# Altium project Thunderscope_Rev3.PrjPCB
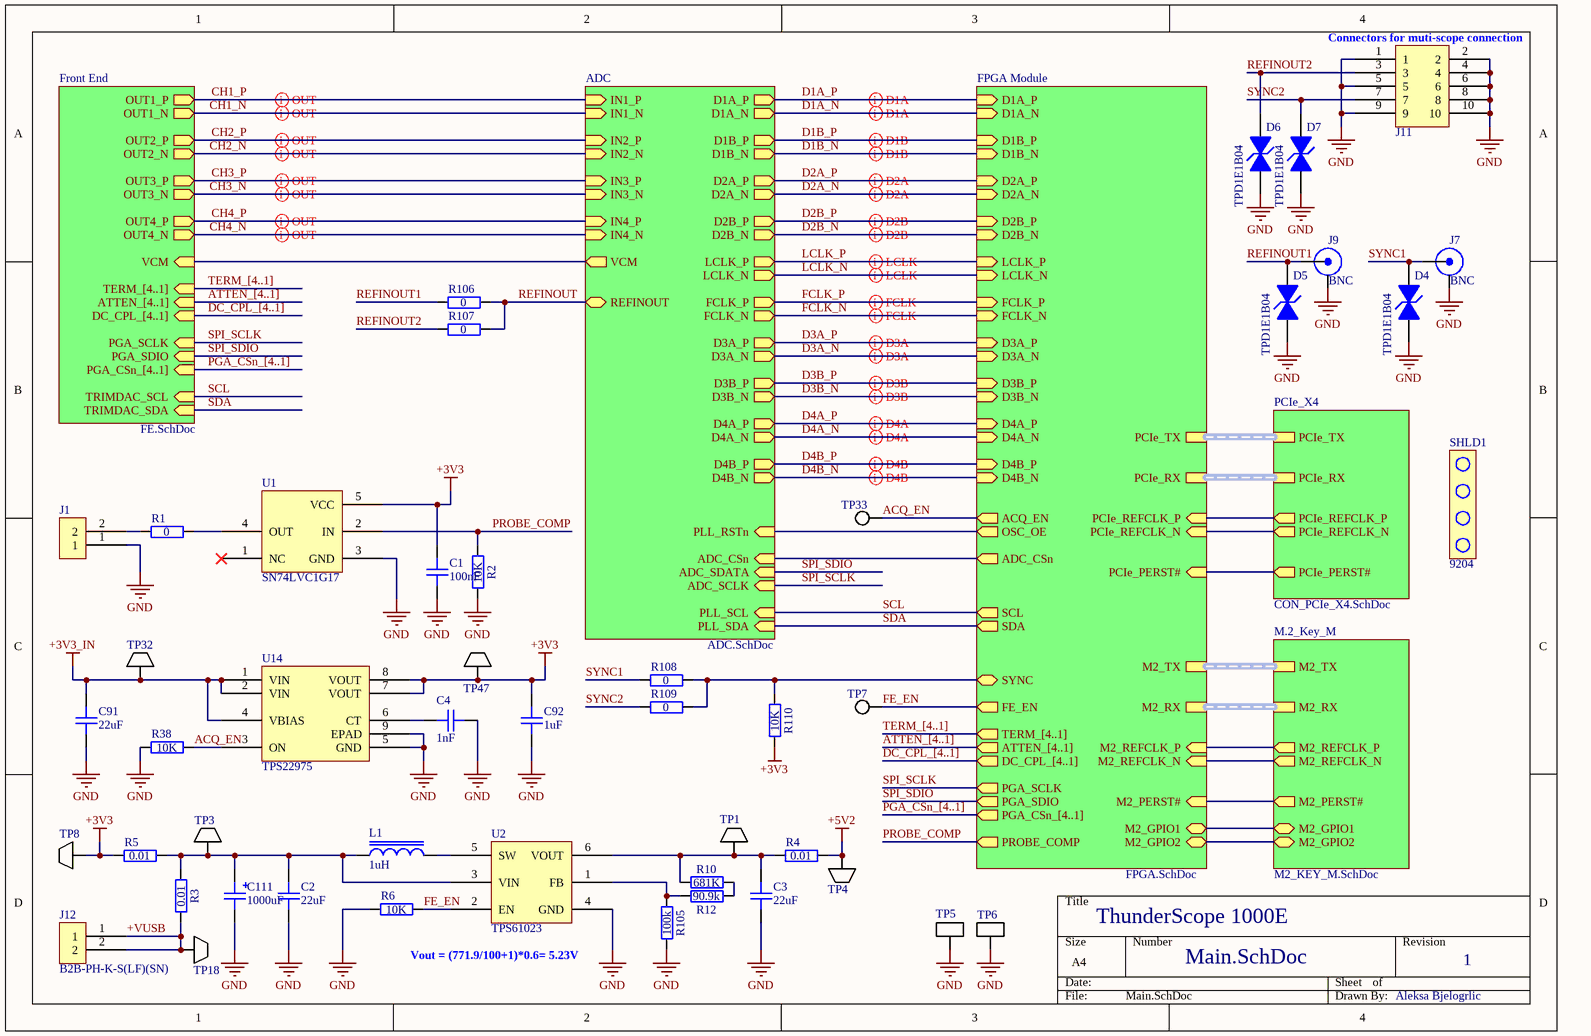
[diagram p0: Main.SchDoc]
Template Notes: - Nominal values used, dimensions in mm  - The mounting holes and keep-out areas around them are only required when the I/O bracket is mounted on the card directly  - Component height rule and clearance rule derived from PCI_Express_CEM_r2.0.pdf, Page 84.  - Stackup is not specified in PCI_Express_CEM_r2.0.pdf, nor implemented in this template.; Template Revision Date: Oct 29, 2010; Template Source Document: Outline:PCI_Express_CEM_r2.0.pdf  Pinout:PCI_Express_CEM_r2.0.pdf; Template Source Organization: PCI-SIG; Template Source Revision Date: R2.0, April 11, 2007; Template Source URL: http://www.pcisig.com; Title: ThunderScope 1000E
5 sheets, 147 parts. Net scope: hierarchical (ports join the sheet entries above them; power ports are global).
Board file: Thunderscope_Rev3.PCBDOC
Sheets:
  Main.SchDoc
    FPGA Module = FPGA.SchDoc
    M.2_Key_M = M2_KEY_M.SchDoc
    PCIe_X4 = CON_PCIe_X4.SchDoc
  PLL.SchDoc

## Sheet Main.SchDoc: ThunderScope 1000E
size A4; DrawnBy: Aleksa Bjelogrlic; Revision: 1

### Parts
C1  100nF  [GEN_C_0402]
C2  22uF  [GEN_C_0805]
C3  22uF  [GEN_C_0805]
C4  1nF  [GEN_C_0402]
C91  22uF  [GEN_C_0805]
C92  1uF  [GEN_C_0402]
C111  1000uF  [GEN_C_POLAR_10mm]
D4  TPD1E1B04  [TI_X1SON_DPY0002A]
D5  TPD1E1B04  [TI_X1SON_DPY0002A]
D6  TPD1E1B04  [TI_X1SON_DPY0002A]
D7  TPD1E1B04  [TI_X1SON_DPY0002A]
J1  TSW-101-08-F-D-RA  [GEN_2.54mm_1x2_Pin_TH_RA]  (value not drawn)
J7  BNC  [MOL_0731000105]
J9  BNC  [MOL_0731000105]
J11  1.27mm 6 Pin TH  [GEN_1.27mm_2x5_Pin_TH_RA]  (value not drawn)
J12  B2B-PH-K-S(LF)(SN)  [JST_B2B-PH-K-S(LF)(SN)]
L1  1uH  [GEN_L_1210]
R1  0  [GEN_R_0402]
R2  10K  [GEN_R_0402]
R3  0.01  [GEN_R_0603]
R4  0.01  [GEN_R_0603]
R5  0.01  [GEN_R_0603]
R6  10K  [GEN_R_0402]
R10  681K  [GEN_R_0402]
R12  90.9k  [GEN_R_0402]
R38  10K  [GEN_R_0402]
R105  100k  [GEN_R_0402]
R106  0  [GEN_R_0402]
R107  0  [GEN_R_0402]
R108  0  [GEN_R_0402]
R109  0  [GEN_R_0402]
R110  10K  [GEN_R_0402]
SHLD1  9204  (mechanical)
TP1  5015  [KEY_5015]  (value not drawn)
TP3  5015  [KEY_5015]  (value not drawn)
TP4  5015  [KEY_5015]  (value not drawn)
TP5  5019  [KEY_5019]  (value not drawn)
TP6  5019  [KEY_5019]  (value not drawn)
TP7  PCB  [GEN_TP_PCB]  (value not drawn)  (no BOM)
TP8  5015  [KEY_5015]  (value not drawn)
TP18  5015  [KEY_5015]  (value not drawn)
TP32  5015  [KEY_5015]  (value not drawn)
TP33  PCB  [GEN_TP_PCB]  (value not drawn)  (no BOM)
TP47  5015  [KEY_5015]  (value not drawn)
U1  SN74LVC1G17  [GEN_SC-70-5]
U2  TPS61023  [TI_SOT563_DRL0006A]
U14  TPS22975  [TI_WSON8_DSG0008A]

### Sub-sheets
ADC = ADC.SchDoc (file not in this document): IN4_N (in), IN4_P (in), IN3_N (in), IN3_P (in), IN2_N (in), IN2_P (in), VCM (out), IN1_N (in), IN1_P (in), ADC_CSn (in), ADC_SDATA (in), ADC_SCLK (in), D1A_N (out), D1A_P (out), D1B_P (out), D1B_N (out), D2A_P (out), D2A_N (out), D2B_N (out), D2B_P (out), LCLK_P (out), LCLK_N (out), FCLK_N (out), FCLK_P (out), D3A_P (out), D3A_N (out), D3B_P (out), D3B_N (out), D4A_P (out), D4A_N (out), D4B_P (out), D4B_N (out), PLL_RSTn (in), PLL_SDA (in), PLL_SCL (in), REFINOUT (bidir)
FPGA Module = FPGA.SchDoc: D1A_P (in), D1A_N (in), D1B_P (in), D1B_N (in), D2A_P (in), D2A_N (in), D2B_P (in), D2B_N (in), LCLK_P (in), LCLK_N (in), FCLK_P (in), FCLK_N (in), D3A_P (in), D3A_N (in), D3B_P (in), D3B_N (in), D4A_P (in), D4A_N (in), D4B_P (in), D4B_N (in), ACQ_EN (out), OSC_OE (out), ADC_CSn (out), SCL (out), SDA (out), FE_EN (out), ATTEN_[4..1] (out), DC_CPL_[4..1] (out), PGA_SCLK (out), PGA_SDIO (out), PGA_CSn_[4..1] (out), PROBE_COMP (out), PCIe_REFCLK_N (in), PCIe_PERST# (in), PCIe_REFCLK_P (in), PCIe_TX (harness PCIe_X4_TX), PCIe_RX (harness PCIe_X4_RX), M2_REFCLK_N (in), M2_PERST# (in), M2_REFCLK_P (in), M2_TX (harness M2_X4_TX), M2_RX (harness M2_X4_RX), TERM_[4..1] (out), M2_GPIO1 (bidir), M2_GPIO2 (bidir), SYNC (bidir)
Front End = FE.SchDoc (file not in this document): OUT1_P (out), OUT1_N (out), OUT3_P (out), OUT3_N (out), OUT4_N (out), OUT2_N (out), OUT2_P (out), OUT4_P (out), VCM (in), DC_CPL_[4..1] (in), ATTEN_[4..1] (in), PGA_SCLK (in), PGA_CSn_[4..1] (in), PGA_SDIO (in), TRIMDAC_SCL (in), TRIMDAC_SDA (in), TERM_[4..1] (in)
M.2_Key_M = M2_KEY_M.SchDoc: M2_REFCLK_N (out), M2_PERST# (out), M2_REFCLK_P (out), M2_TX (harness M2_X4_TX), M2_RX (harness M2_X4_RX), M2_GPIO1 (bidir), M2_GPIO2 (bidir)
PCIe_X4 = CON_PCIe_X4.SchDoc: PCIe_REFCLK_N (out), PCIe_PERST# (out), PCIe_REFCLK_P (out), PCIe_TX (harness PCIe_X4_TX), PCIe_RX (harness PCIe_X4_RX)

### Nets
+3V3: C1.1 C92.2 R5.2 R110.1 TP8.1 TP47.1 U1.5(VCC) U14.7(VOUT) U14.8(VOUT)
+3V3_IN: C91.2 TP32.1 U14.1(VIN) U14.2(VIN) U14.4(VBIAS)
+5V2: R4.2 TP4.1
GND: C1.2 C2.1 C3.1 C4.1 C91.1 C92.1 C111.2 D4.2(A) D5.2(A) D6.2(A) D7.2(A) J1.1 J7.2(SHIELD) J9.2(SHIELD) J11.1 J11.2 J11.4 J11.5 J11.6 J11.8 J11.9 J11.10 R2.1 R6.2 R38.1 R105.1 TP5.1 TP6.1 U1.3(GND) U2.4(GND) U14.5(GND) U14.9(EPAD)
+VUSB: J12.1 J12.2 R3.2 TP18.1
ACQ_EN: R38.2 TP33.1 U14.3(ON) ; sheet FPGA Module/ACQ_EN
ADC_CSn: sheet ADC/ADC_CSn, sheet FPGA Module/ADC_CSn
CH1_N: sheet Front End/OUT1_N, sheet ADC/IN1_N
CH1_P: sheet Front End/OUT1_P, sheet ADC/IN1_P
CH2_N: sheet Front End/OUT2_N, sheet ADC/IN2_N
CH2_P: sheet Front End/OUT2_P, sheet ADC/IN2_P
CH3_N: sheet Front End/OUT3_N, sheet ADC/IN3_N
CH3_P: sheet Front End/OUT3_P, sheet ADC/IN3_P
CH4_N: sheet Front End/OUT4_N, sheet ADC/IN4_N
CH4_P: sheet Front End/OUT4_P, sheet ADC/IN4_P
D1A_N: sheet ADC/D1A_N, sheet FPGA Module/D1A_N
D1A_P: sheet ADC/D1A_P, sheet FPGA Module/D1A_P
D1B_N: sheet ADC/D1B_N, sheet FPGA Module/D1B_N
D1B_P: sheet ADC/D1B_P, sheet FPGA Module/D1B_P
D2A_N: sheet ADC/D2A_N, sheet FPGA Module/D2A_N
D2A_P: sheet ADC/D2A_P, sheet FPGA Module/D2A_P
D2B_N: sheet ADC/D2B_N, sheet FPGA Module/D2B_N
D2B_P: sheet ADC/D2B_P, sheet FPGA Module/D2B_P
D3A_N: sheet ADC/D3A_N, sheet FPGA Module/D3A_N
D3A_P: sheet ADC/D3A_P, sheet FPGA Module/D3A_P
D3B_N: sheet ADC/D3B_N, sheet FPGA Module/D3B_N
D3B_P: sheet ADC/D3B_P, sheet FPGA Module/D3B_P
D4A_N: sheet ADC/D4A_N, sheet FPGA Module/D4A_N
D4A_P: sheet ADC/D4A_P, sheet FPGA Module/D4A_P
D4B_N: sheet ADC/D4B_N, sheet FPGA Module/D4B_N
D4B_P: sheet ADC/D4B_P, sheet FPGA Module/D4B_P
FCLK_N: sheet ADC/FCLK_N, sheet FPGA Module/FCLK_N
FCLK_P: sheet ADC/FCLK_P, sheet FPGA Module/FCLK_P
FE_EN: R6.1 TP7.1 U2.2(EN) ; sheet FPGA Module/FE_EN
LCLK_N: sheet ADC/LCLK_N, sheet FPGA Module/LCLK_N
LCLK_P: sheet ADC/LCLK_P, sheet FPGA Module/LCLK_P
M2_GPIO1: sheet FPGA Module/M2_GPIO1, sheet M.2_Key_M/M2_GPIO1
M2_GPIO2: sheet FPGA Module/M2_GPIO2, sheet M.2_Key_M/M2_GPIO2
M2_PERST#: sheet FPGA Module/M2_PERST#, sheet M.2_Key_M/M2_PERST#
M2_REFCLK_N: sheet FPGA Module/M2_REFCLK_N, sheet M.2_Key_M/M2_REFCLK_N
M2_REFCLK_P: sheet FPGA Module/M2_REFCLK_P, sheet M.2_Key_M/M2_REFCLK_P
OSC_OE: sheet ADC/PLL_RSTn, sheet FPGA Module/OSC_OE
PCIe_PERST#: sheet FPGA Module/PCIe_PERST#, sheet PCIe_X4/PCIe_PERST#
PCIe_REFCLK_N: sheet FPGA Module/PCIe_REFCLK_N, sheet PCIe_X4/PCIe_REFCLK_N
PCIe_REFCLK_P: sheet FPGA Module/PCIe_REFCLK_P, sheet PCIe_X4/PCIe_REFCLK_P
PROBE_COMP: R2.2 U1.2(IN) ; sheet FPGA Module/PROBE_COMP
REFINOUT: R106.2 R107.2 ; sheet ADC/REFINOUT
REFINOUT1: D5.1(K) J9.1(Signal) R106.1
REFINOUT2: D6.1(K) J11.3 R107.1
SCL: sheet Front End/TRIMDAC_SCL, sheet ADC/PLL_SCL, sheet FPGA Module/SCL
SDA: sheet Front End/TRIMDAC_SDA, sheet ADC/PLL_SDA, sheet FPGA Module/SDA
SPI_SCLK: sheet Front End/PGA_SCLK, sheet ADC/ADC_SCLK, sheet FPGA Module/PGA_SCLK
SPI_SDIO: sheet Front End/PGA_SDIO, sheet ADC/ADC_SDATA, sheet FPGA Module/PGA_SDIO
SYNC: R108.2 R109.2 R110.2 ; sheet FPGA Module/SYNC
SYNC1: D4.1(K) J7.1(Signal) R108.1
SYNC2: D7.1(K) J11.7 R109.1
NetC2_2: C2.2 C111.1 L1.1 R3.1 R5.1 TP3.1 U2.3(VIN)
NetC3_2: C3.2 R4.1 R10.2 TP1.1 U2.6(VOUT)
NetC4_2: C4.2 U14.6(CT)
NetJ1_2: J1.2 R1.1
NetL1_2: L1.2 U2.5(SW)
NetR1_2: R1.2 U1.4(OUT)
NetR10_1: R10.1 R12.2
NetR12_1: R12.1 R105.2 U2.1(FB)
(unnamed): sheet Front End/VCM, sheet ADC/VCM

Not connected (* = marked no-connect by the designer): U1 1(NC)*

### Buses and harness runs
bus ATTEN_[4..1] = sheet FPGA Module/ATTEN_[4..1]
bus ATTEN_[4..1] = sheet Front End/ATTEN_[4..1]
bus DC_CPL_[4..1] = sheet FPGA Module/DC_CPL_[4..1]
bus DC_CPL_[4..1] = sheet Front End/DC_CPL_[4..1]
bus PGA_CSn_[4..1] = sheet FPGA Module/PGA_CSn_[4..1]
bus PGA_CSn_[4..1] = sheet Front End/PGA_CSn_[4..1]
bus TERM_[4..1] = sheet FPGA Module/TERM_[4..1]
bus TERM_[4..1] = sheet Front End/TERM_[4..1]
harness sheet FPGA Module/M2_RX = sheet M.2_Key_M/M2_RX
harness sheet FPGA Module/M2_TX = sheet M.2_Key_M/M2_TX
harness sheet FPGA Module/PCIe_RX = sheet PCIe_X4/PCIe_RX
harness sheet FPGA Module/PCIe_TX = sheet PCIe_X4/PCIe_TX

### Layout directives
differential pair: D1A_N, D1A_P, D1B_N, D1B_P, D2A_N, D2A_P, D2B_N, D2B_P, D3A_N, D3A_P, D3B_N, D3B_P, D4A_N, D4A_P, D4B_N, D4B_P, FCLK_N, FCLK_P, LCLK_N, LCLK_P
differential pair; differential pair class 100Z_Diff_PGA: CH1_N, CH1_P, CH2_N, CH2_P, CH3_N, CH3_P, CH4_N, CH4_P

### Notes on the sheet
- (near J11) Connectors for muti-scope connection
- Vout = (771.9/100+1)*0.6= 5.23V
- Aleksa Bjelogrlic

### Library data of the parts
C1 = CAP 100nF 16V X7R 0402: Voltage Rating: 16V; Package: 0402; Supplier 1: Digi-Key; Supplier Part Number 1: 490-4759-1-ND; Value: 100nF
C2 C3 C91 = CAP 22uF 25V X5R 0805: Voltage Rating: 25V; Package: 0805; Value: 22uF; Supplier 1: Digi-Key; Supplier Part Number 1: 490-10749-1-ND
C4 = CAP 1nF 50V C0G 0402: Voltage Rating: 50V; Package: 0402; Supplier 1: Digi-Key; Supplier Part Number 1: 490-6189-1-ND; Value: 1nF
C92 = CAP 1uF 25V X5R 0402: Voltage Rating: 25V; Package: 0402; Value: 1uF; Supplier 1: Digi-Key; Supplier Part Number 1: 490-10017-1-ND
C111 = CAP 1000uF 16V 10mm Dia: Voltage Rating: 16V; Package: 10mm; Value: 1000uF; Supplier 1: Digi-Key; Supplier Part Number 1: P124991CT-ND
D4-D7 = TVS TPD1E1B04: Supplier 1: Digi-Key; Supplier Part Number 1: 296-47364-1-ND
J1 = CONN 2.54mm 2 Pin TH RA: Supplier 1: Digi-Key; Supplier Part Number 1: SAM12296-ND
J7 J9 = BNC JACK R/A: Supplier 1: Digi-Key; Supplier Part Number 1: WM5524-ND
J11 = CONN 1.27mm 2x5 Pin TH RA: Supplier 1: Digi-Key; Supplier Part Number 1: 1175-1628-ND
J12 = CONN JST PH 2 Pin TH: Supplier 1: Digi-Key; Supplier Part Number 1: 455-1704-ND
L1 = IND 1uH 3.1A 45 MOHM 1210: Value: 1uH; Supplier 1: Digi-Key; Supplier Part Number 1: 490-10590-1-ND
R1 R106-R109 = RES 0 OHM 1/16W 0402: Power Rating: 0.0625W; Package: 0402; Supplier 1: Digi-Key; Supplier Part Number 1: 311-0.0JRCT-ND; Value: 0
R2 R6 R38 R110 = RES 10K OHM 1% 1/10W 0402: Tolerance: 1%; Power Rating: 0.1W; Package: 0402; Supplier 1: Digi-Key; Supplier Part Number 1: P10.0KLCT-ND; Value: 10K
R3-R5 = RES 0.01 OHM 1% 1/4W 0603: Tolerance: 1%; Power Rating: 0.25W; Supplier 1: Digi-Key; Supplier Part Number 1: 408-1404-1-ND; Value: 0.01; Package: 0603
R10 = RES 681K OHM 1% 1/16W 0402: Tolerance: 1%; Power Rating: 0.0625W; Package: 0402; Supplier 1: Digi-Key; Supplier Part Number 1: YAG3212CT-ND; Value: 681K
R12 = RES 90.9K OHM 1% 1/16W 0402: Tolerance: 1%; Power Rating: 0.0625W; Package: 0402; Supplier 1: Digi-Key; Supplier Part Number 1: 311-90.9KLRCT-ND; Value: 90.9k
R105 = RES 100K OHM 1% 1/10W 0402: Tolerance: 1%; Power Rating: 0.1W; Package: 0402; Supplier 1: Digi-Key; Supplier Part Number 1: 311-100KLRCT-ND; Value: 100k
SHLD1 = PCIe IO Shield: Supplier 1: Mouser; Supplier Part Number 1: 534-9204
TP1 TP3 TP4 TP8 TP18 TP32 TP47 = TP KEYSTONE 5015: Supplier 1: Digi-Key; Supplier Part Number 1: 36-5015CT-ND
TP5 TP6 = TP KEYSTONE 5019: Supplier 1: Digi-Key; Supplier Part Number 1: 36-5019CT-ND
TP7 TP33 = TP PCB 1mm
U1 = IC BUFFER SN74LVC1G17: Supplier 1: Digi-Key; Supplier Part Number 1: 296-11934-1-ND
U2 = IC BOOST TPS61023: Supplier 1: Digi-Key; Supplier Part Number 1: 296-TPS61023DRLTCT-ND
U14 = IC SWITCH LOAD TPS22975: Supplier 1: Digi-Key; Supplier Part Number 1: 296-47228-1-ND

## Sheet FPGA.SchDoc: ThunderScope 1000E
size A4; DrawnBy: Aleksa Bjelogrlic; Revision: 1
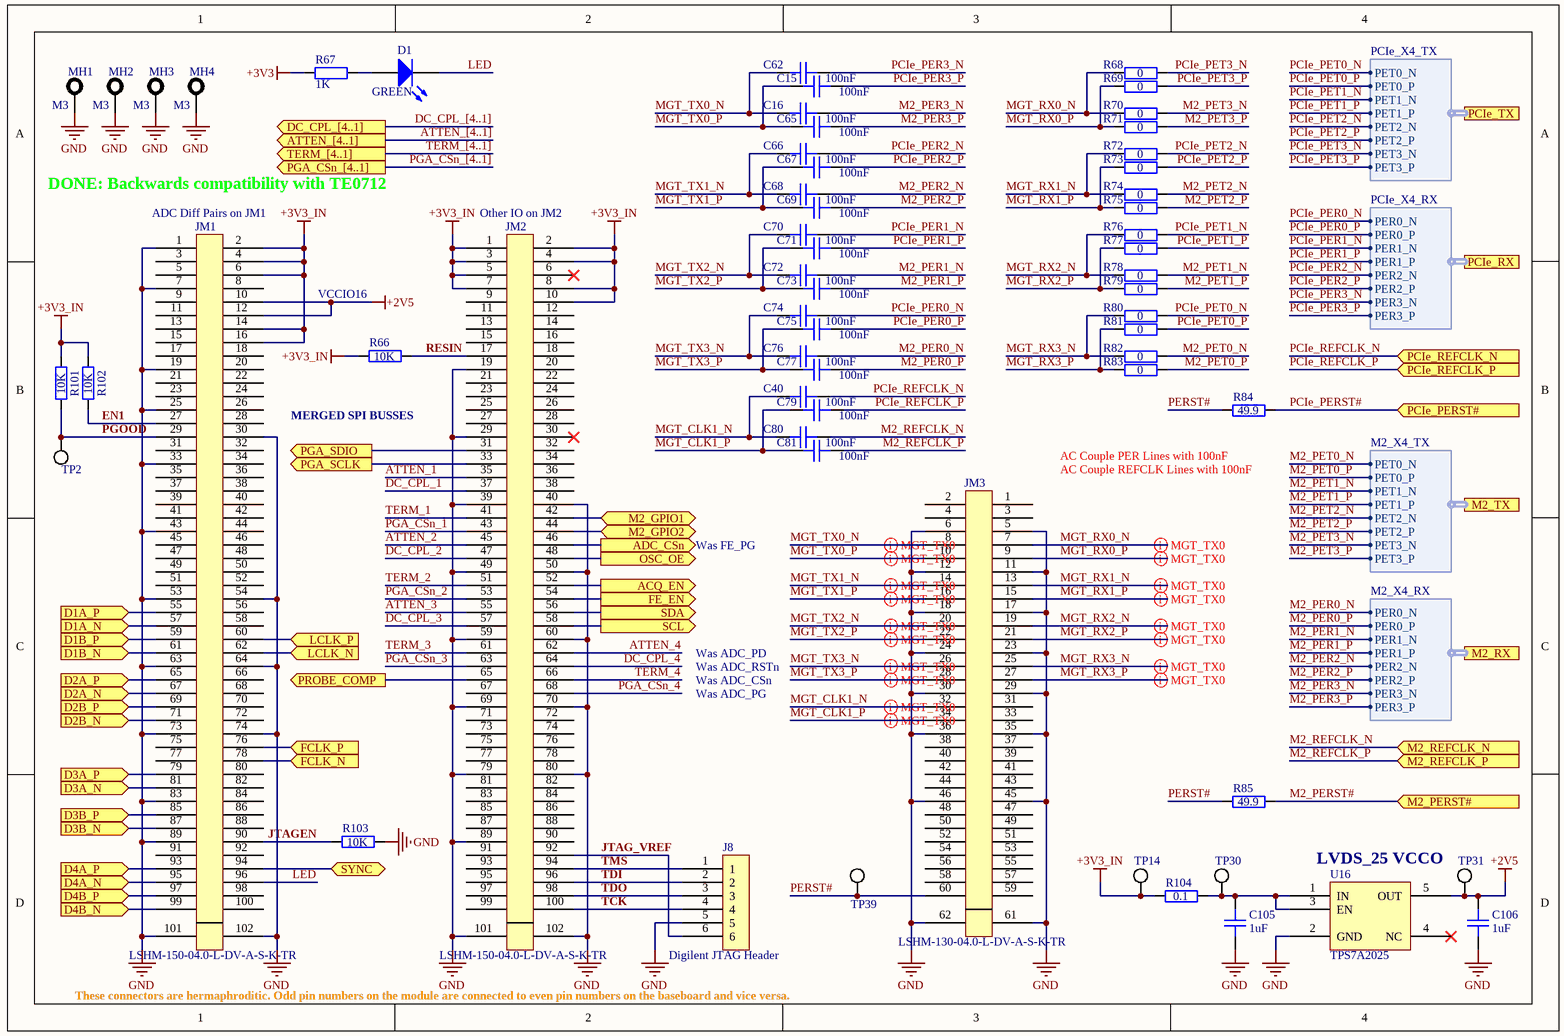
[diagram p1: FPGA.SchDoc]

### Parts
C15  100nF  [GEN_C_0201]
C16  100nF  [GEN_C_0201]
C40  100nF  [GEN_C_0201]
C62  100nF  [GEN_C_0201]
C65  100nF  [GEN_C_0201]
C66  100nF  [GEN_C_0201]
C67  100nF  [GEN_C_0201]
C68  100nF  [GEN_C_0201]
C69  100nF  [GEN_C_0201]
C70  100nF  [GEN_C_0201]
C71  100nF  [GEN_C_0201]
C72  100nF  [GEN_C_0201]
C73  100nF  [GEN_C_0201]
C74  100nF  [GEN_C_0201]
C75  100nF  [GEN_C_0201]
C76  100nF  [GEN_C_0201]
C77  100nF  [GEN_C_0201]
C79  100nF  [GEN_C_0201]
C80  100nF  [GEN_C_0201]
C81  100nF  [GEN_C_0201]
C105  1uF  [GEN_C_0402]
C106  1uF  [GEN_C_0402]
D1  GREEN  [LED_0603_LTST-S270K]
J8  2.54mm 6 Pin TH  [GEN_2.54mm_6_Pin_TH_RA]  (value not drawn)
JM1  LSHM-150-04.0-L-DV-A-S-K-TR  [SAM_LSHM-150-XX.X-XX-DV-A-S]
JM2  LSHM-150-04.0-L-DV-A-S-K-TR  [SAM_LSHM-150-XX.X-XX-DV-A-S]
JM3  LSHM-130-04.0-L-DV-A-S-K-TR  [SAM_LSHM-130-XX.X-XX-DV-A-S]
MH1  M3  [MH M3]  (no BOM)
MH2  M3  [MH M3]  (no BOM)
MH3  M3  [MH M3]  (no BOM)
MH4  M3  [MH M3]  (no BOM)
R66  10K  [GEN_R_0402]
R67  1K  [GEN_R_0402]
R68  0  [GEN_R_0201]
R69  0  [GEN_R_0201]
R70  0  [GEN_R_0201]
R71  0  [GEN_R_0201]
R72  0  [GEN_R_0201]
R73  0  [GEN_R_0201]
R74  0  [GEN_R_0201]
R75  0  [GEN_R_0201]
R76  0  [GEN_R_0201]
R77  0  [GEN_R_0201]
R78  0  [GEN_R_0201]
R79  0  [GEN_R_0201]
R80  0  [GEN_R_0201]
R81  0  [GEN_R_0201]
R82  0  [GEN_R_0201]
R83  0  [GEN_R_0201]
R84  49.9  [GEN_R_0402]
R85  49.9  [GEN_R_0402]
R101  10K  [GEN_R_0402]
R102  10K  [GEN_R_0402]
R103  10K  [GEN_R_0402]
R104  0.1  [GEN_R_0402]
TP2  PCB  [GEN_TP_PCB]  (value not drawn)  (no BOM)
TP14  PCB  [GEN_TP_PCB]  (value not drawn)  (no BOM)
TP30  PCB  [GEN_TP_PCB]  (value not drawn)  (no BOM)
TP31  PCB  [GEN_TP_PCB]  (value not drawn)  (no BOM)
TP39  PCB  [GEN_TP_PCB]  (value not drawn)  (no BOM)
U16  TPS7A2025  [GEN_SOT23_5_950_2900X1600X1450]

### Ports
ACQ_EN (out), ADC_CSn (out), ATTEN_[4..1] (out), D1A_N (in), D1A_P (in), D1B_N (in), D1B_P (in), D2A_N (in), D2A_P (in), D2B_N (in), D2B_P (in), D3A_N (in), D3A_P (in), D3B_N (in), D3B_P (in), D4A_N (in), D4A_P (in), D4B_N (in), D4B_P (in), DC_CPL_[4..1] (out), FCLK_N (in), FCLK_P (in), FE_EN (out), LCLK_N (in), LCLK_P (in), M2_GPIO1 (bidir), M2_GPIO2 (bidir), M2_PERST# (in), M2_REFCLK_N (in), M2_REFCLK_P (in), M2_RX (harness M2_X4_RX), M2_TX (harness M2_X4_TX), OSC_OE (out), PCIe_PERST# (in), PCIe_REFCLK_N (in), PCIe_REFCLK_P (in), PCIe_RX (harness PCIe_X4_RX), PCIe_TX (harness PCIe_X4_TX), PGA_CSn_[4..1] (out), PGA_SCLK (out), PGA_SDIO (out), PROBE_COMP (out), SCL (out), SDA (out), SYNC (bidir), TERM_[4..1] (out)

### Harnesses
PCIe_X4_RX: PER0_N, PER0_P, PER1_N, PER1_P, PER2_N, PER2_P, PER3_N, PER3_P
PCIe_X4_TX: PET0_N, PET0_P, PET1_N, PET1_P, PET2_N, PET2_P, PET3_N, PET3_P
M2_X4_RX: PER0_N, PER0_P, PER1_N, PER1_P, PER2_N, PER2_P, PER3_N, PER3_P
M2_X4_TX: PET0_N, PET0_P, PET1_N, PET1_P, PET2_N, PET2_P, PET3_N, PET3_P

### Nets
+2V5: C106.2 JM1.10 JM1.12 TP31.1 U16.5(OUT)
+3V3: R67.2
+3V3_IN: JM1.2 JM1.4 JM1.6 JM1.14 JM1.16 JM2.1 JM2.2 JM2.3 JM2.4 JM2.5 JM2.7 JM2.8 JM2.10 R66.2 R101.2 R102.2 R104.1 TP14.1
GND: C105.1 C106.1 J8.5 JM1.1 JM1.7 JM1.19 JM1.25 JM1.30 JM1.33 JM1.43 JM1.53 JM1.54 JM1.63 JM1.64 JM1.73 JM1.74 JM1.83 JM1.89 JM1.101 JM1.102 JM2.19 JM2.29 JM2.39 JM2.40 JM2.49 JM2.50 JM2.59 JM2.60 JM2.69 JM2.70 JM2.79 JM2.80 JM2.89 JM2.101 JM2.102 JM3.5 JM3.6 JM3.11 JM3.12 JM3.17 JM3.18 JM3.23 JM3.24 JM3.29 JM3.30 JM3.35 JM3.36 JM3.45 JM3.46 JM3.61 JM3.62 MH1.1 MH2.1 MH3.1 MH4.1 R103.1 U16.2(GND)
ACQ_EN: JM2.52 ; port ACQ_EN
ADC_CSn: JM2.46 ; port ADC_CSn
ATTEN_1: JM2.35
ATTEN_2: JM2.45
ATTEN_3: JM2.55
ATTEN_4: JM2.62
D1A_N: JM1.57 ; port D1A_N
D1A_P: JM1.55 ; port D1A_P
D1B_N: JM1.61 ; port D1B_N
D1B_P: JM1.59 ; port D1B_P
D2A_N: JM1.67 ; port D2A_N
D2A_P: JM1.65 ; port D2A_P
D2B_N: JM1.71 ; port D2B_N
D2B_P: JM1.69 ; port D2B_P
D3A_N: JM1.81 ; port D3A_N
D3A_P: JM1.79 ; port D3A_P
D3B_N: JM1.87 ; port D3B_N
D3B_P: JM1.85 ; port D3B_P
D4A_N: JM1.95 ; port D4A_N
D4A_P: JM1.93 ; port D4A_P
D4B_N: JM1.99 ; port D4B_N
D4B_P: JM1.97 ; port D4B_P
DC_CPL_1: JM2.37
DC_CPL_2: JM2.47
DC_CPL_3: JM2.57
DC_CPL_4: JM2.64
EN1: JM1.27 R102.1
FCLK_N: JM1.78 ; port FCLK_N
FCLK_P: JM1.76 ; port FCLK_P
FE_EN: JM2.54 ; port FE_EN
JTAG_VREF: J8.6 JM2.92
JTAGEN: JM1.90 R103.2
LCLK_N: JM1.62 ; port LCLK_N
LCLK_P: JM1.60 ; port LCLK_P
LED: D1.1(K) JM1.96
M2_GPIO1: JM2.42 ; port M2_GPIO1
M2_GPIO2: JM2.44 ; port M2_GPIO2
M2_PER0_N: C76.1 ; port M2_RX.PER0_N
M2_PER0_P: C77.1 ; port M2_RX.PER0_P
M2_PER1_N: C72.1 ; port M2_RX.PER1_N
M2_PER1_P: C73.1 ; port M2_RX.PER1_P
M2_PER2_N: C68.1 ; port M2_RX.PER2_N
M2_PER2_P: C69.1 ; port M2_RX.PER2_P
M2_PER3_N: C16.1 ; port M2_RX.PER3_N
M2_PER3_P: C65.1 ; port M2_RX.PER3_P
M2_PERST#: R85.2 ; port M2_PERST#
M2_PET0_N: R82.2 ; port M2_TX.PET0_N
M2_PET0_P: R83.2 ; port M2_TX.PET0_P
M2_PET1_N: R78.2 ; port M2_TX.PET1_N
M2_PET1_P: R79.2 ; port M2_TX.PET1_P
M2_PET2_N: R74.2 ; port M2_TX.PET2_N
M2_PET2_P: R75.2 ; port M2_TX.PET2_P
M2_PET3_N: R70.2 ; port M2_TX.PET3_N
M2_PET3_P: R71.2 ; port M2_TX.PET3_P
M2_REFCLK_N: C80.1 ; port M2_REFCLK_N
M2_REFCLK_P: C81.1 ; port M2_REFCLK_P
MGT_CLK1_N: C40.2 C80.2 JM3.32
MGT_CLK1_P: C79.2 C81.2 JM3.34
MGT_RX0_N: JM3.7 R68.1 R70.1
MGT_RX0_P: JM3.9 R69.1 R71.1
MGT_RX1_N: JM3.13 R72.1 R74.1
MGT_RX1_P: JM3.15 R73.1 R75.1
MGT_RX2_N: JM3.19 R76.1 R78.1
MGT_RX2_P: JM3.21 R77.1 R79.1
MGT_RX3_N: JM3.25 R80.1 R82.1
MGT_RX3_P: JM3.27 R81.1 R83.1
MGT_TX0_N: C16.2 C62.2 JM3.8
MGT_TX0_P: C15.2 C65.2 JM3.10
MGT_TX1_N: C66.2 C68.2 JM3.14
MGT_TX1_P: C67.2 C69.2 JM3.16
MGT_TX2_N: C70.2 C72.2 JM3.20
MGT_TX2_P: C71.2 C73.2 JM3.22
MGT_TX3_N: C74.2 C76.2 JM3.26
MGT_TX3_P: C75.2 C77.2 JM3.28
OSC_OE: JM2.48 ; port OSC_OE
PCIe_PER0_N: C74.1 ; port PCIe_RX.PER0_N
PCIe_PER0_P: C75.1 ; port PCIe_RX.PER0_P
PCIe_PER1_N: C70.1 ; port PCIe_RX.PER1_N
PCIe_PER1_P: C71.1 ; port PCIe_RX.PER1_P
PCIe_PER2_N: C66.1 ; port PCIe_RX.PER2_N
PCIe_PER2_P: C67.1 ; port PCIe_RX.PER2_P
PCIe_PER3_N: C62.1 ; port PCIe_RX.PER3_N
PCIe_PER3_P: C15.1 ; port PCIe_RX.PER3_P
PCIe_PERST#: R84.2 ; port PCIe_PERST#
PCIe_PET0_N: R80.2 ; port PCIe_TX.PET0_N
PCIe_PET0_P: R81.2 ; port PCIe_TX.PET0_P
PCIe_PET1_N: R76.2 ; port PCIe_TX.PET1_N
PCIe_PET1_P: R77.2 ; port PCIe_TX.PET1_P
PCIe_PET2_N: R72.2 ; port PCIe_TX.PET2_N
PCIe_PET2_P: R73.2 ; port PCIe_TX.PET2_P
PCIe_PET3_N: R68.2 ; port PCIe_TX.PET3_N
PCIe_PET3_P: R69.2 ; port PCIe_TX.PET3_P
PCIe_REFCLK_N: C40.1 ; port PCIe_REFCLK_N
PCIe_REFCLK_P: C79.1 ; port PCIe_REFCLK_P
PERST#: JM3.60 R84.1 R85.1 TP39.1
PGA_CSn_1: JM2.43
PGA_CSn_2: JM2.53
PGA_CSn_3: JM2.63
PGA_CSn_4: JM2.68
PGOOD: JM1.29 R101.1 TP2.1
PROBE_COMP: JM2.65 ; port PROBE_COMP
RESIN: JM2.17 R66.1
SCL: JM2.58 ; port SCL
SDA: JM2.56 ; port SDA
SPI_SCLK: JM2.33 ; port PGA_SCLK
SPI_SDIO: JM2.31 ; port PGA_SDIO
SYNC: JM1.94 ; port SYNC
TCK: J8.4 JM2.100
TDI: J8.2 JM2.96
TDO: J8.3 JM2.98
TERM_1: JM2.41
TERM_2: JM2.51
TERM_3: JM2.61
TERM_4: JM2.66
TMS: J8.1 JM2.94
NetC105_2: C105.2 R104.2 TP30.1 U16.1(IN) U16.3(EN)
NetD1_2: D1.2(A) R67.1

Not connected (* = marked no-connect by the designer): JM1 3 5 8 9 11 13 15 17 18 20 21 22 23 24 26 28 31 32 34 35 36 37 38 39 40 41 42 44 45 46 47 48 49 50 51 52 56 58 66 68 70 72 75 77 80 82 84 86 88 91 92 98 100; JM2 6* 9 11 12 13 14 15 16 18 20 21 22 23 24 25 26 27 28 30* 32 34 36 38 67 71 72 73 74 75 76 77 78 81 82 83 84 85 86 87 88 90 91 93 95 97 99; JM3 1 2 3 4 31 33 37 38 39 40 41 42 43 44 47 48 49 50 51 52 53 54 55 56 57 58 59; U16 4(NC)*

### Buses and harness runs
bus ATTEN_[4..1] = port ATTEN_[4..1]
bus DC_CPL_[4..1] = port DC_CPL_[4..1]
bus PGA_CSn_[4..1] = port PGA_CSn_[4..1]
bus TERM_[4..1] = port TERM_[4..1]

### Layout directives
differential pair; differential pair class PCIe: MGT_CLK1_N, MGT_CLK1_P, MGT_RX0_N, MGT_RX0_P, MGT_RX1_N, MGT_RX1_P, MGT_RX2_N, MGT_RX2_P, MGT_RX3_N, MGT_RX3_P, MGT_TX0_N, MGT_TX0_P, MGT_TX1_N, MGT_TX1_P, MGT_TX2_N, MGT_TX2_P, MGT_TX3_N, MGT_TX3_P

### Notes on the sheet
- DONE: Backwards compatibility with TE0712
- (near JM1) ADC Diff Pairs on JM1
- (near JM2) Other IO on JM2
- VCCIO16
- MERGED SPI BUSSES
- (near R84) AC Couple PER Lines with 100nF
- AC Couple REFCLK Lines with 100nF
- Was FE_PG
- Was ADC_PD
- Was ADC_RSTn
- Was ADC_PG
- Was ADC_CSn
- (near U16) LVDS_25 VCCO
- (near J8) Digilent JTAG Header
- These connectors are hermaphroditic. Odd pin numbers on the module are connected to even pin numbers on the baseboard and vice versa.

### Library data of the parts
C15 C16 C40 C62 C65-C77 C79-C81 = CAP 100nF 6.3V X5R 0201: Voltage Rating: 6.3V; Package: 0201; Supplier 1: Digi-Key; Supplier Part Number 1: 490-3167-1-ND; Value: 100nF
C105 C106 = CAP 1uF 25V X5R 0402: Voltage Rating: 25V; Package: 0402; Supplier 1: Digi-Key; Supplier Part Number 1: 490-10017-1-ND; Value: 1uF
D1 = LED GREEN 0603 LTST-S270K: Supplier 1: Digi-Key; Supplier Part Number 1: 160-1478-1-ND
J8 = CONN 2.54mm 6 Pin TH RA: Supplier 1: Digi-Key; Supplier Part Number 1: 732-5339-ND
JM1 JM2 = CONN LSHM-150-04.0-L-DV-A-S-K-TR: Supplier 1: Digi-Key; Supplier Part Number 1: SAM9033CT-ND
JM3 = CONN LSHM-130-04.0-L-DV-A-S-K-TR: Supplier 1: Digi-Key; Supplier Part Number 1: SAM9034CT-ND
MH1-MH4 = MH M3
R66 R101-R103 = RES 10K OHM 1% 1/10W 0402: Tolerance: 1%; Power Rating: 0.1W; Package: 0402; Supplier 1: Digi-Key; Supplier Part Number 1: P10.0KLCT-ND; Value: 10K
R67 = RES 1K OHM 1% 1/10W 0402: Tolerance: 1%; Power Rating: 0.1W; Package: 0402; Supplier 1: Digi-Key; Supplier Part Number 1: 311-1.00KLRCT-ND; Value: 1K
R68-R83 = RES 0 OHM 1% 1/20W 0201: Power Rating: 0.05W; Tolerance: 1%; Package: 0201; Supplier 1: Digi-Key; Supplier Part Number 1: RMCF0201ZT0R00CT-ND; Value: 0
R84 R85 = RES 49.9 OHM 1% 1/10W 0402: Tolerance: 1%; Power Rating: 0.1W; Package: 0402; Supplier 1: Digi-Key; Supplier Part Number 1: 311-49.9LRCT-ND; Value: 49.9
R104 = RES 0.1 OHM 1% 1/6W 0402: Tolerance: 1%; Power Rating: 0.16W; Package: 0402; Supplier 1: Digi-Key; Supplier Part Number 1: P.10AKCT-ND; Value: 0.1
TP2 TP14 TP30 TP31 TP39 = TP PCB 1mm
U16 = IC LDO TPS7A2025: Supplier 1: Digi-Key; Supplier Part Number 1: 296-TPS7A2025PDBVRCT-ND

## Sheet M2_KEY_M.SchDoc: ThunderScope 1000E
size A4
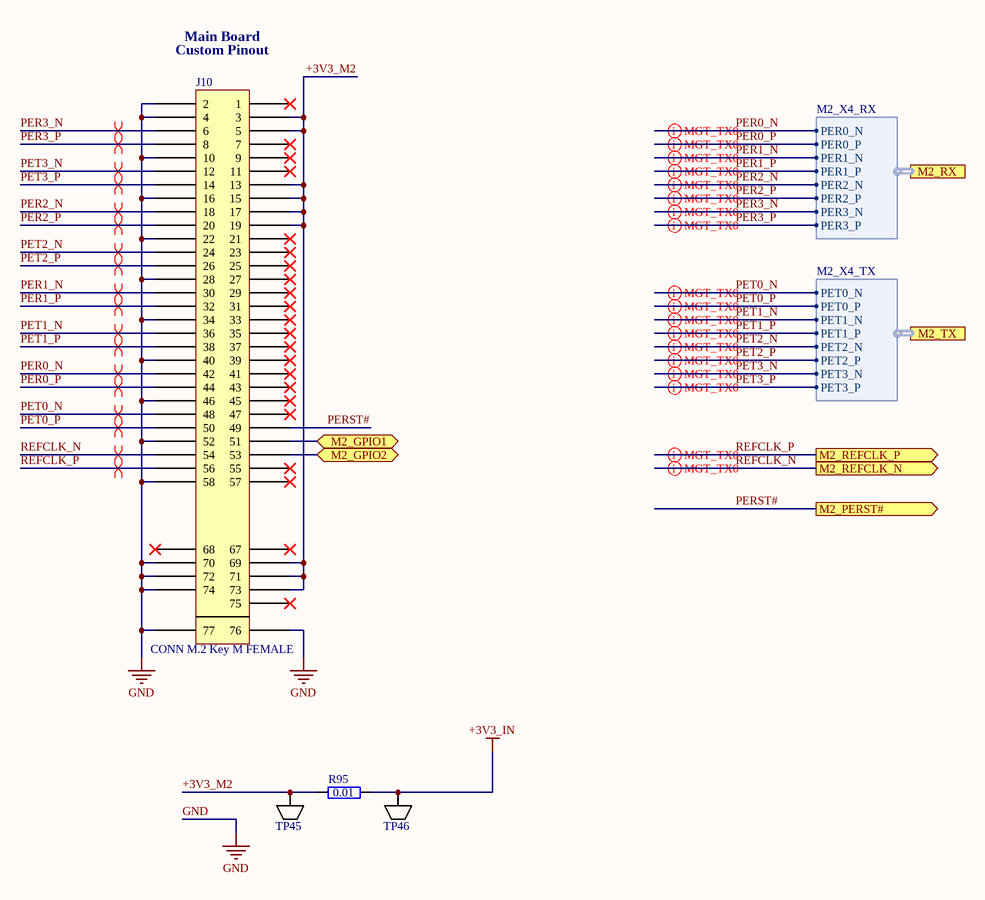
[diagram p2: M2_KEY_M.SchDoc]

### Parts
J10  CONN M.2 Key M FEMALE  [TE_M2_KEYM_2199230]
R95  0.01  [GEN_R_0603]
TP45  5015  [KEY_5015]  (value not drawn)
TP46  5015  [KEY_5015]  (value not drawn)

### Ports
M2_GPIO1 (bidir), M2_GPIO2 (bidir), M2_PERST# (out), M2_REFCLK_N (out), M2_REFCLK_P (out), M2_RX (harness M2_X4_RX), M2_TX (harness M2_X4_TX)

### Harnesses
M2_X4_RX: PER0_N, PER0_P, PER1_N, PER1_P, PER2_N, PER2_P, PER3_N, PER3_P
M2_X4_TX: PET0_N, PET0_P, PET1_N, PET1_P, PET2_N, PET2_P, PET3_N, PET3_P

### Nets
+3V3_IN: R95.2 TP46.1
GND: J10.2 J10.4 J10.10 J10.16 J10.22 J10.28 J10.34 J10.40 J10.46 J10.52 J10.58 J10.70 J10.72 J10.74 J10.76 J10.77
+3V3_M2: J10.3 J10.5 J10.13 J10.15 J10.17 J10.19 J10.69 J10.71 J10.73 R95.1 TP45.1
M2_GPIO1: J10.51 ; port M2_GPIO1
M2_GPIO2: J10.53 ; port M2_GPIO2
PER0_N: J10.42 ; port M2_RX.PER0_N  [project net M2_PER0_N]
PER0_P: J10.44 ; port M2_RX.PER0_P  [project net M2_PER0_P]
PER1_N: J10.30 ; port M2_RX.PER1_N  [project net M2_PER1_N]
PER1_P: J10.32 ; port M2_RX.PER1_P  [project net M2_PER1_P]
PER2_N: J10.18 ; port M2_RX.PER2_N  [project net M2_PER2_N]
PER2_P: J10.20 ; port M2_RX.PER2_P  [project net M2_PER2_P]
PER3_N: J10.6 ; port M2_RX.PER3_N  [project net M2_PER3_N]
PER3_P: J10.8 ; port M2_RX.PER3_P  [project net M2_PER3_P]
PERST#: J10.49 ; port M2_PERST#  [project net M2_PERST#]
PET0_N: J10.48 ; port M2_TX.PET0_N  [project net M2_PET0_N]
PET0_P: J10.50 ; port M2_TX.PET0_P  [project net M2_PET0_P]
PET1_N: J10.36 ; port M2_TX.PET1_N  [project net M2_PET1_N]
PET1_P: J10.38 ; port M2_TX.PET1_P  [project net M2_PET1_P]
PET2_N: J10.24 ; port M2_TX.PET2_N  [project net M2_PET2_N]
PET2_P: J10.26 ; port M2_TX.PET2_P  [project net M2_PET2_P]
PET3_N: J10.12 ; port M2_TX.PET3_N  [project net M2_PET3_N]
PET3_P: J10.14 ; port M2_TX.PET3_P  [project net M2_PET3_P]
REFCLK_N: J10.54 ; port M2_REFCLK_N  [project net M2_REFCLK_N]
REFCLK_P: J10.56 ; port M2_REFCLK_P  [project net M2_REFCLK_P]

Not connected (* = marked no-connect by the designer): J10 1* 7* 9* 11* 21* 23* 25* 27* 29* 31* 33* 35* 37* 39* 41* 43* 45* 47* 55* 57* 67* 68* 75*

### Layout directives
differential pair; differential pair class PCIe: M2_PER0_N, M2_PER0_P, M2_PER1_N, M2_PER1_P, M2_PER2_N, M2_PER2_P, M2_PER3_N, M2_PER3_P, M2_PET0_N, M2_PET0_P, M2_PET1_N, M2_PET1_P, M2_PET2_N, M2_PET2_P, M2_PET3_N, M2_PET3_P, M2_REFCLK_N, M2_REFCLK_P

### Notes on the sheet
- Main Board
- (near J10) Custom Pinout

### Library data of the parts
R95 = RES 0.01 OHM 1% 1/4W 0603: Tolerance: 1%; Power Rating: 0.25W; Supplier 1: Digi-Key; Supplier Part Number 1: 408-1404-1-ND; Value: 0.01; Package: 0603
TP45 TP46 = TP KEYSTONE 5015: Supplier 1: Digi-Key; Supplier Part Number 1: 36-5015CT-ND
J10 = CONN M.2 Key M FEMALE: Supplier 1: Digi-Key; Supplier Part Number 1: A124992CT-ND

## Sheet CON_PCIe_X4.SchDoc: ThunderScope 1000E
size A4; DrawnBy: Aleksa Bjelogrlic; Revision: 1
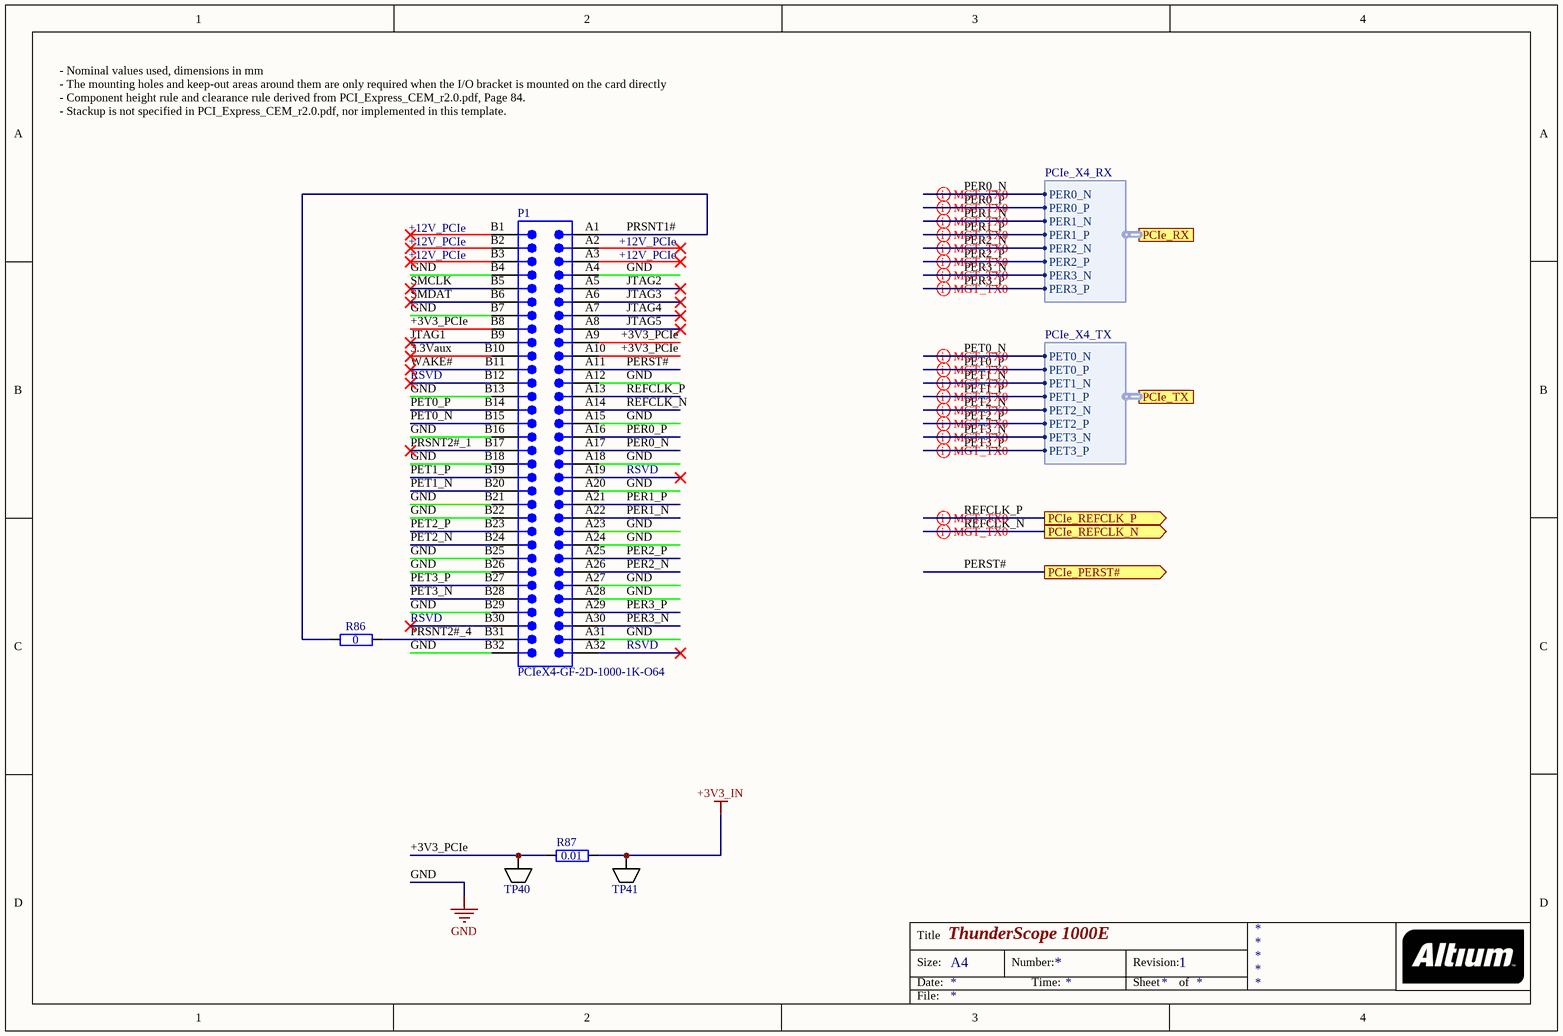
[diagram p3: CON_PCIe_X4.SchDoc]

### Parts
P1  PCIeX4-GF-2D-1000-1K-O64  [PCIeX4-GF-2D-1000-1K-O64]  (no BOM)
R86  0  [GEN_R_0402]
R87  0.01  [GEN_R_0603]
TP40  5015  [KEY_5015]  (value not drawn)
TP41  5015  [KEY_5015]  (value not drawn)

### Ports
PCIe_PERST# (out), PCIe_REFCLK_N (out), PCIe_REFCLK_P (out), PCIe_RX (harness PCIe_X4_RX), PCIe_TX (harness PCIe_X4_TX)

### Harnesses
PCIe_X4_RX: PER0_N, PER0_P, PER1_N, PER1_P, PER2_N, PER2_P, PER3_N, PER3_P
PCIe_X4_TX: PET0_N, PET0_P, PET1_N, PET1_P, PET2_N, PET2_P, PET3_N, PET3_P

### Nets
+3V3_IN: R87.2 TP41.1
GND: P1.A4 P1.A12 P1.A15 P1.A18 P1.A20 P1.A23 P1.A24 P1.A27 P1.A28 P1.A31 P1.B4 P1.B7 P1.B13 P1.B16 P1.B18 P1.B21 P1.B22 P1.B25 P1.B26 P1.B29 P1.B32
3.3Vaux: P1.B10
+3V3_PCIe: P1.A9 P1.A10 P1.B8 R87.1 TP40.1
JTAG1: P1.B9
JTAG2: P1.A5
JTAG3: P1.A6
JTAG4: P1.A7
JTAG5: P1.A8
PER0_N: P1.A17 ; port PCIe_RX.PER0_N  [project net PCIe_PER0_N]
PER0_P: P1.A16 ; port PCIe_RX.PER0_P  [project net PCIe_PER0_P]
PER1_N: P1.A22 ; port PCIe_RX.PER1_N  [project net PCIe_PER1_N]
PER1_P: P1.A21 ; port PCIe_RX.PER1_P  [project net PCIe_PER1_P]
PER2_N: P1.A26 ; port PCIe_RX.PER2_N  [project net PCIe_PER2_N]
PER2_P: P1.A25 ; port PCIe_RX.PER2_P  [project net PCIe_PER2_P]
PER3_N: P1.A30 ; port PCIe_RX.PER3_N  [project net PCIe_PER3_N]
PER3_P: P1.A29 ; port PCIe_RX.PER3_P  [project net PCIe_PER3_P]
PERST#: P1.A11 ; port PCIe_PERST#  [project net PCIe_PERST#]
PET0_N: P1.B15 ; port PCIe_TX.PET0_N  [project net PCIe_PET0_N]
PET0_P: P1.B14 ; port PCIe_TX.PET0_P  [project net PCIe_PET0_P]
PET1_N: P1.B20 ; port PCIe_TX.PET1_N  [project net PCIe_PET1_N]
PET1_P: P1.B19 ; port PCIe_TX.PET1_P  [project net PCIe_PET1_P]
PET2_N: P1.B24 ; port PCIe_TX.PET2_N  [project net PCIe_PET2_N]
PET2_P: P1.B23 ; port PCIe_TX.PET2_P  [project net PCIe_PET2_P]
PET3_N: P1.B28 ; port PCIe_TX.PET3_N  [project net PCIe_PET3_N]
PET3_P: P1.B27 ; port PCIe_TX.PET3_P  [project net PCIe_PET3_P]
PRSNT1#: P1.A1 R86.1
PRSNT2#_1: P1.B17
PRSNT2#_4: P1.B31 R86.2
REFCLK_N: P1.A14 ; port PCIe_REFCLK_N  [project net PCIe_REFCLK_N]
REFCLK_P: P1.A13 ; port PCIe_REFCLK_P  [project net PCIe_REFCLK_P]
SMCLK: P1.B5
SMDAT: P1.B6
WAKE#: P1.B11

Not connected (* = marked no-connect by the designer): P1 A2* A3* A19* A32* B1* B2* B3* B12* B30*

### Layout directives
differential pair; differential pair class PCIe: PCIe_PER0_N, PCIe_PER0_P, PCIe_PER1_N, PCIe_PER1_P, PCIe_PER2_N, PCIe_PER2_P, PCIe_PER3_N, PCIe_PER3_P, PCIe_PET0_N, PCIe_PET0_P, PCIe_PET1_N, PCIe_PET1_P, PCIe_PET2_N, PCIe_PET2_P, PCIe_PET3_N, PCIe_PET3_P, PCIe_REFCLK_N, PCIe_REFCLK_P

### Notes on the sheet
- - Nominal values used, dimensions in mm
  - The mounting holes and keep-out areas around them are only required when the I/O bracket is mounted on the card directly
  - Component height rule and clearance rule derived from PCI_Express_CEM_r2.0.pdf, Page 84.
  - Stackup is not specified in PCI_Express_CEM_r2.0.pdf, nor implemented in this template.
- +12V_PCIe
- (near P1) +12V_PCIe
- RSVD
- (near R86) RSVD
- Title
- Size:
- Date:
- A4
- Number:
- Time:
- Revision:
- Sheet
- of
- File:

### Library data of the parts
P1 = CMP-0001-00031-2: Golden finger, PCIeX4, Dual, Opposite, Pitch 1mm, 64-Position; Mating Connector: Molex-87715-9106; Datasheet Version: rev2.0, Apr-2007; Package Reference: PCIeX4-GF-2D-1000-1K-O64; ClassName: Edge Connector; Publisher: Altium
R86 = RES 0 OHM 1/16W 0402: Power Rating: 0.0625W; Package: 0402; Supplier 1: Digi-Key; Supplier Part Number 1: 311-0.0JRCT-ND; Value: 0
R87 = RES 0.01 OHM 1% 1/4W 0603: Tolerance: 1%; Power Rating: 0.25W; Supplier 1: Digi-Key; Supplier Part Number 1: 408-1404-1-ND; Value: 0.01; Package: 0603
TP40 TP41 = TP KEYSTONE 5015: Supplier 1: Digi-Key; Supplier Part Number 1: 36-5015CT-ND

## Sheet PLL.SchDoc: ThunderScope 1000E
size A4
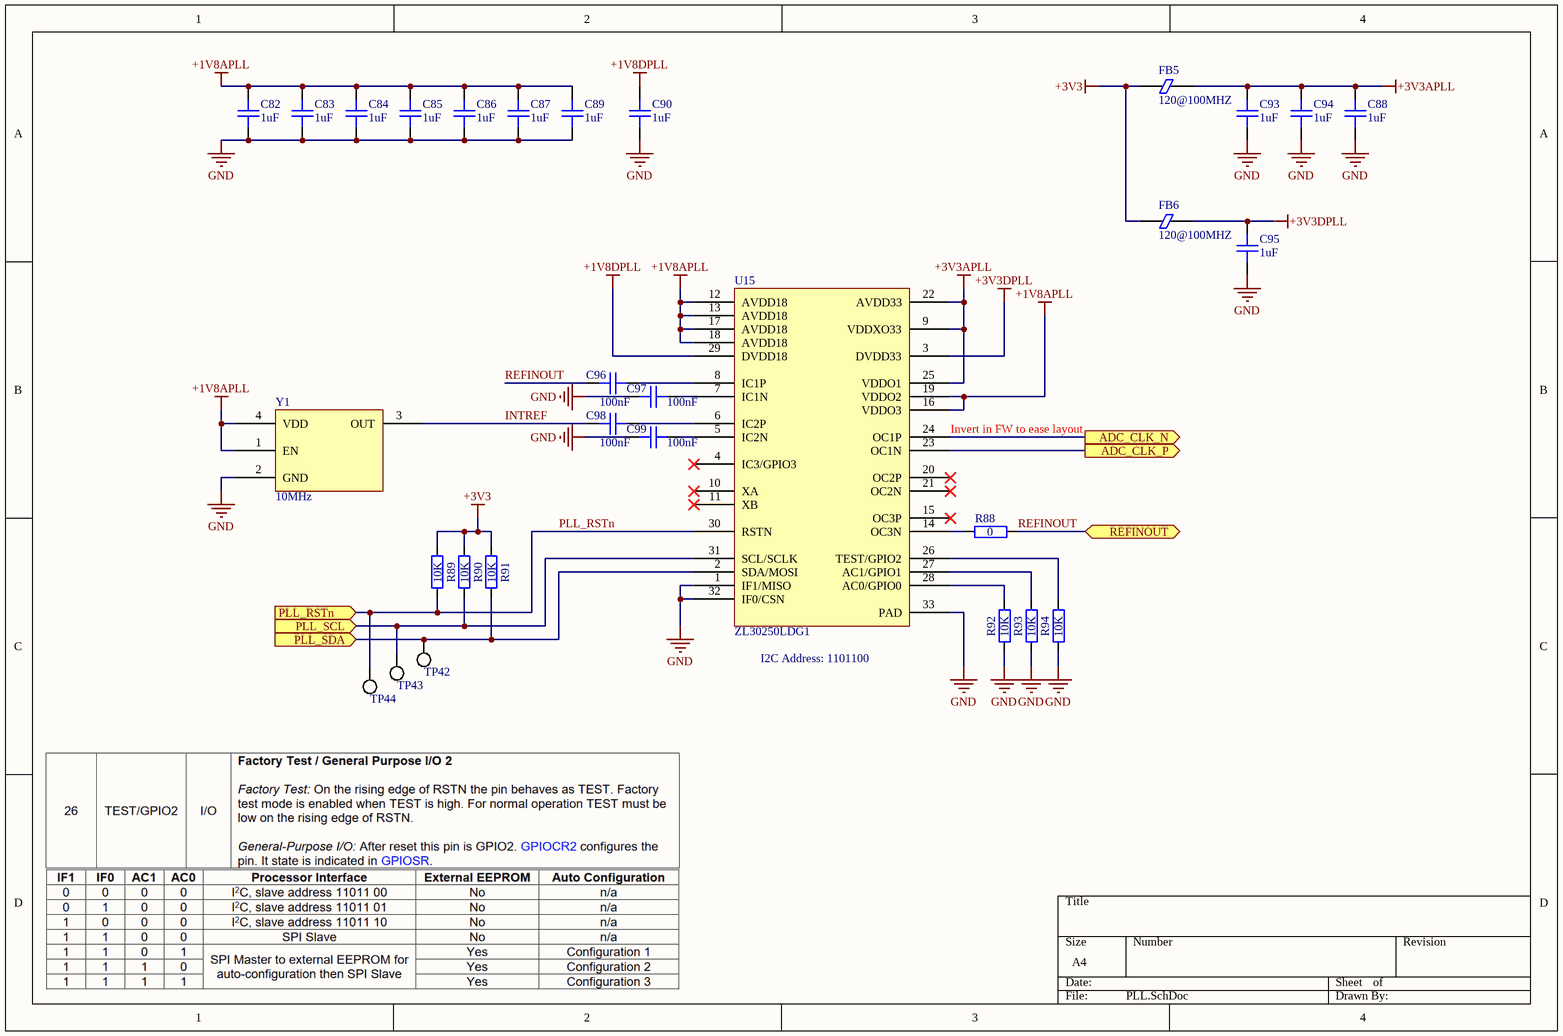
[diagram p4: PLL.SchDoc]

### Parts
C82  1uF  [GEN_C_0402]
C83  1uF  [GEN_C_0402]
C84  1uF  [GEN_C_0402]
C85  1uF  [GEN_C_0402]
C86  1uF  [GEN_C_0402]
C87  1uF  [GEN_C_0402]
C88  1uF  [GEN_C_0402]
C89  1uF  [GEN_C_0402]
C90  1uF  [GEN_C_0402]
C93  1uF  [GEN_C_0402]
C94  1uF  [GEN_C_0402]
C95  1uF  [GEN_C_0402]
C96  100nF  [GEN_C_0402]
C97  100nF  [GEN_C_0402]
C98  100nF  [GEN_C_0402]
C99  100nF  [GEN_C_0402]
FB5  120@100MHZ  [GEN_R_0402]
FB6  120@100MHZ  [GEN_R_0402]
R88  0  [GEN_R_0402]
R89  10K  [GEN_R_0402]
R90  10K  [GEN_R_0402]
R91  10K  [GEN_R_0402]
R92  10K  [GEN_R_0402]
R93  10K  [GEN_R_0402]
R94  10K  [GEN_R_0402]
TP42  PCB  [GEN_TP_PCB]  (value not drawn)  (no BOM)
TP43  PCB  [GEN_TP_PCB]  (value not drawn)  (no BOM)
TP44  PCB  [GEN_TP_PCB]  (value not drawn)  (no BOM)
U15  ZL30250LDG1  [MC_QFN32_ZL30250]
Y1  10MHz  [ECS_TXO-3225]

### Ports
ADC_CLK_N (out), ADC_CLK_P (out), PLL_RSTn (in), PLL_SCL (in), PLL_SDA (in), REFINOUT (bidir)

### Nets
+1V8APLL: C82.1 C83.1 C84.1 C85.1 C86.1 C87.1 C89.1 U15.12(AVDD18) U15.13(AVDD18) U15.16(VDDO3) U15.17(AVDD18) U15.18(AVDD18) U15.19(VDDO2) Y1.1(EN) Y1.4(VDD)
+1V8DPLL: C90.1 U15.29(DVDD18)
+3V3: FB5.1 FB6.1 R89.2 R90.2 R91.2
+3V3APLL: C88.1 C93.1 C94.1 FB5.2 U15.9(VDDXO33) U15.22(AVDD33) U15.25(VDDO1)
+3V3DPLL: C95.1 FB6.2 U15.3(DVDD33)
GND: C82.2 C83.2 C84.2 C85.2 C86.2 C87.2 C88.2 C89.2 C90.2 C93.2 C94.2 C95.2 C97.2 C99.2 R92.1 R93.1 R94.1 U15.1(IF1/MISO) U15.32(IF0/CSN) U15.33(PAD) Y1.2(GND)
ADC_CLK_N: U15.24(OC1P) ; port ADC_CLK_N
ADC_CLK_P: U15.23(OC1N) ; port ADC_CLK_P
INTREF: C98.2 Y1.3(OUT)
PLL_RSTn: R89.1 TP44.1 U15.30(RSTN) ; port PLL_RSTn
PLL_SCL: R90.1 TP43.1 U15.31(SCL/SCLK) ; port PLL_SCL
PLL_SDA: R91.1 TP42.1 U15.2(SDA/MOSI) ; port PLL_SDA
REFINOUT: C96.2 R88.2 ; port REFINOUT
NetC96_1: C96.1 U15.8(IC1P)
NetC97_1: C97.1 U15.7(IC1N)
NetC98_1: C98.1 U15.6(IC2P)
NetC99_1: C99.1 U15.5(IC2N)
NetR88_1: R88.1 U15.14(OC3N)
NetR92_2: R92.2 U15.28(AC0/GPIO0)
NetR93_2: R93.2 U15.27(AC1/GPIO1)
NetR94_2: R94.2 U15.26(TEST/GPIO2)

Not connected (* = marked no-connect by the designer): U15 4(IC3/GPIO3)* 10(XA)* 11(XB)* 15(OC3P)* 20(OC2P)* 21(OC2N)*

### Notes on the sheet
- (near U15) Invert in FW to ease layout
- (near U15) I2C Address: 1101100

### Library data of the parts
C82-C90 C93-C95 = CAP 1uF 25V X5R 0402: Voltage Rating: 25V; Package: 0402; Supplier 1: Digi-Key; Supplier Part Number 1: 490-10017-1-ND; Value: 1uF
C96-C99 = CAP 100nF 16V X7R 0402: Voltage Rating: 16V; Package: 0402; Supplier 1: Digi-Key; Supplier Part Number 1: 490-4759-1-ND; Value: 100nF
FB5 FB6 = FERRITE BEAD 120 OHM 0402: Supplier 1: Digi-Key; Supplier Part Number 1: 490-9656-1-ND
R88 = RES 0 OHM 1/16W 0402: Power Rating: 0.0625W; Package: 0402; Supplier 1: Digi-Key; Supplier Part Number 1: 311-0.0JRCT-ND; Value: 0
R89-R94 = RES 10K OHM 1% 1/10W 0402: Tolerance: 1%; Power Rating: 0.1W; Package: 0402; Supplier 1: Digi-Key; Supplier Part Number 1: P10.0KLCT-ND; Value: 10K
TP42-TP44 = TP PCB 1mm
U15 = IC CLK GEN ZL30250LDG1: Supplier 1: Mouser; Supplier Part Number 1: 494-ZL30250LDG1
Y1 = OSC 10MHz ECS-TXO-3225MV: Supplier 1: Digi-Key; Supplier Part Number 1: 50-ECS-TXO-3225MV-100-CT-ND

## Nets that join several sheets
+3V3: Main (9 pins), FPGA (R67.2), PLL (5 pins)
+3V3_IN: Main (5 pins), FPGA (18 pins), M2_KEY_M (R95.2 TP46.1), CON_PCIe_X4 (R87.2 TP41.1)
GND: Main (32 pins), FPGA (57 pins), M2_KEY_M (16 pins), CON_PCIe_X4 (21 pins), PLL (21 pins)
ACQ_EN: Main (R38.2 TP33.1 U14.3), FPGA (JM2.52)
FE_EN: Main (R6.1 TP7.1 U2.2), FPGA (JM2.54)
M2_GPIO1: FPGA (JM2.42), M2_KEY_M (J10.51)
M2_GPIO2: FPGA (JM2.44), M2_KEY_M (J10.53)
M2_PER0_N: FPGA (C76.1), M2_KEY_M (J10.42)
M2_PER0_P: FPGA (C77.1), M2_KEY_M (J10.44)
M2_PER1_N: FPGA (C72.1), M2_KEY_M (J10.30)
M2_PER1_P: FPGA (C73.1), M2_KEY_M (J10.32)
M2_PER2_N: FPGA (C68.1), M2_KEY_M (J10.18)
M2_PER2_P: FPGA (C69.1), M2_KEY_M (J10.20)
M2_PER3_N: FPGA (C16.1), M2_KEY_M (J10.6)
M2_PER3_P: FPGA (C65.1), M2_KEY_M (J10.8)
M2_PERST#: FPGA (R85.2), M2_KEY_M (J10.49)
M2_PET0_N: FPGA (R82.2), M2_KEY_M (J10.48)
M2_PET0_P: FPGA (R83.2), M2_KEY_M (J10.50)
M2_PET1_N: FPGA (R78.2), M2_KEY_M (J10.36)
M2_PET1_P: FPGA (R79.2), M2_KEY_M (J10.38)
M2_PET2_N: FPGA (R74.2), M2_KEY_M (J10.24)
M2_PET2_P: FPGA (R75.2), M2_KEY_M (J10.26)
M2_PET3_N: FPGA (R70.2), M2_KEY_M (J10.12)
M2_PET3_P: FPGA (R71.2), M2_KEY_M (J10.14)
M2_REFCLK_N: FPGA (C80.1), M2_KEY_M (J10.54)
M2_REFCLK_P: FPGA (C81.1), M2_KEY_M (J10.56)
PCIe_PER0_N: FPGA (C74.1), CON_PCIe_X4 (P1.A17)
PCIe_PER0_P: FPGA (C75.1), CON_PCIe_X4 (P1.A16)
PCIe_PER1_N: FPGA (C70.1), CON_PCIe_X4 (P1.A22)
PCIe_PER1_P: FPGA (C71.1), CON_PCIe_X4 (P1.A21)
PCIe_PER2_N: FPGA (C66.1), CON_PCIe_X4 (P1.A26)
PCIe_PER2_P: FPGA (C67.1), CON_PCIe_X4 (P1.A25)
PCIe_PER3_N: FPGA (C62.1), CON_PCIe_X4 (P1.A30)
PCIe_PER3_P: FPGA (C15.1), CON_PCIe_X4 (P1.A29)
PCIe_PERST#: FPGA (R84.2), CON_PCIe_X4 (P1.A11)
PCIe_PET0_N: FPGA (R80.2), CON_PCIe_X4 (P1.B15)
PCIe_PET0_P: FPGA (R81.2), CON_PCIe_X4 (P1.B14)
PCIe_PET1_N: FPGA (R76.2), CON_PCIe_X4 (P1.B20)
PCIe_PET1_P: FPGA (R77.2), CON_PCIe_X4 (P1.B19)
PCIe_PET2_N: FPGA (R72.2), CON_PCIe_X4 (P1.B24)
PCIe_PET2_P: FPGA (R73.2), CON_PCIe_X4 (P1.B23)
PCIe_PET3_N: FPGA (R68.2), CON_PCIe_X4 (P1.B28)
PCIe_PET3_P: FPGA (R69.2), CON_PCIe_X4 (P1.B27)
PCIe_REFCLK_N: FPGA (C40.1), CON_PCIe_X4 (P1.A14)
PCIe_REFCLK_P: FPGA (C79.1), CON_PCIe_X4 (P1.A13)
PROBE_COMP: Main (R2.2 U1.2), FPGA (JM2.65)
SYNC: Main (R108.2 R109.2 R110.2), FPGA (JM1.94)